# Altium schematic sheet TempSensors.SchDoc
size A; SheetNumber: 3; SheetTotal: 7
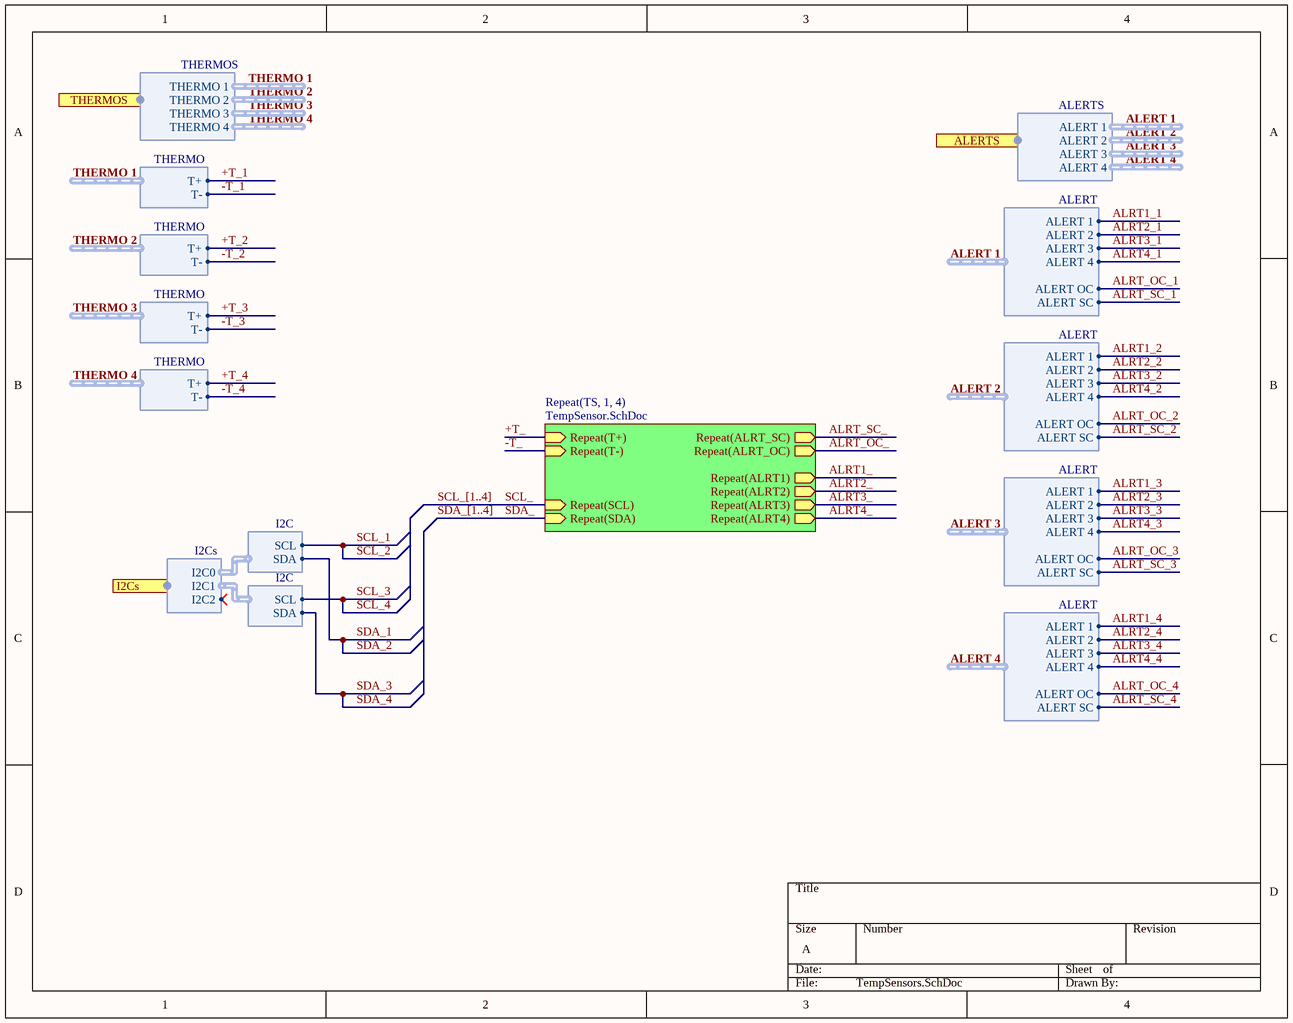
[diagram p0: TempSensors.SchDoc]

## Sub-sheets
Repeat(TS, 1, 4) = TempSensor.SchDoc: Repeat(T+) (in), Repeat(T-) (in), Repeat(ALRT_SC) (out), Repeat(ALRT_OC) (out), Repeat(ALRT1) (out), Repeat(ALRT2) (out), Repeat(ALRT3) (out), Repeat(ALRT4) (out), Repeat(SCL) (in), Repeat(SDA) (in)

## Ports
ALERTS (out, harness ALERTS), I2Cs (harness I2Cs), THERMOS (out, harness THERMOS)

## Harnesses
I2C: SDA, SCL
I2Cs: I2C1, I2C0, I2C2
ALERTS: ALERT 1, ALERT 2, ALERT 3, ALERT 4
ALERT: ALERT SC, ALERT OC, ALERT 1, ALERT 2, ALERT 3, ALERT 4
THERMOS: THERMO 1, THERMO 2, THERMO 3, THERMO 4
THERMO: T+, T-

## Nets
+T_: sheet Repeat(TS, 1, 4)/Repeat(T+)
+T_1: harness THERMO.T+
+T_2: harness THERMO.T+
+T_3: harness THERMO.T+
+T_4: harness THERMO.T+
-T_: sheet Repeat(TS, 1, 4)/Repeat(T-)
-T_1: harness THERMO.T-
-T_2: harness THERMO.T-
-T_3: harness THERMO.T-
-T_4: harness THERMO.T-
ALRT1_: sheet Repeat(TS, 1, 4)/Repeat(ALRT1)
ALRT1_1: harness ALERT.ALERT 1  [project net ALERT 1.ALERT 1]
ALRT1_2: harness ALERT.ALERT 1  [project net ALERT 2.ALERT 1]
ALRT1_3: harness ALERT.ALERT 1  [project net ALERT 3.ALERT 1]
ALRT1_4: harness ALERT.ALERT 1  [project net ALERT 4.ALERT 1]
ALRT2_: sheet Repeat(TS, 1, 4)/Repeat(ALRT2)
ALRT2_1: harness ALERT.ALERT 2  [project net ALERT 1.ALERT 2]
ALRT2_2: harness ALERT.ALERT 2  [project net ALERT 2.ALERT 2]
ALRT2_3: harness ALERT.ALERT 2  [project net ALERT 3.ALERT 2]
ALRT2_4: harness ALERT.ALERT 2  [project net ALERT 4.ALERT 2]
ALRT3_: sheet Repeat(TS, 1, 4)/Repeat(ALRT3)
ALRT3_1: harness ALERT.ALERT 3  [project net ALERT 1.ALERT 3]
ALRT3_2: harness ALERT.ALERT 3  [project net ALERT 2.ALERT 3]
ALRT3_3: harness ALERT.ALERT 3  [project net ALERT 3.ALERT 3]
ALRT3_4: harness ALERT.ALERT 3  [project net ALERT 4.ALERT 3]
ALRT4_: sheet Repeat(TS, 1, 4)/Repeat(ALRT4)
ALRT4_1: harness ALERT.ALERT 4  [project net ALERT 1.ALERT 4]
ALRT4_2: harness ALERT.ALERT 4  [project net ALERT 2.ALERT 4]
ALRT4_3: harness ALERT.ALERT 4  [project net ALERT 3.ALERT 4]
ALRT4_4: harness ALERT.ALERT 4  [project net ALERT 4.ALERT 4]
ALRT_OC_: sheet Repeat(TS, 1, 4)/Repeat(ALRT_OC)
ALRT_OC_1: harness ALERT.ALERT OC  [project net ALERT 1.ALERT OC]
ALRT_OC_2: harness ALERT.ALERT OC  [project net ALERT 2.ALERT OC]
ALRT_OC_3: harness ALERT.ALERT OC  [project net ALERT 3.ALERT OC]
ALRT_OC_4: harness ALERT.ALERT OC  [project net ALERT 4.ALERT OC]
ALRT_SC_: sheet Repeat(TS, 1, 4)/Repeat(ALRT_SC)
ALRT_SC_1: harness ALERT.ALERT SC  [project net ALERT 1.ALERT SC]
ALRT_SC_2: harness ALERT.ALERT SC  [project net ALERT 2.ALERT SC]
ALRT_SC_3: harness ALERT.ALERT SC  [project net ALERT 3.ALERT SC]
ALRT_SC_4: harness ALERT.ALERT SC  [project net ALERT 4.ALERT SC]
SCL_: sheet Repeat(TS, 1, 4)/Repeat(SCL)
SCL_1: harness I2C.SCL  [also labelled SCL_2]
SCL_3: harness I2C.SCL  [also labelled SCL_4]
SDA_: sheet Repeat(TS, 1, 4)/Repeat(SDA)
SDA_1: harness I2C.SDA  [also labelled SDA_2]
SDA_3: harness I2C.SDA  [also labelled SDA_4]

## Buses and harness runs
bus SCL_[1..4]
bus SDA_[1..4]